# EAGLE design single_ad8232_d1 (EAGLE 9.6.1)
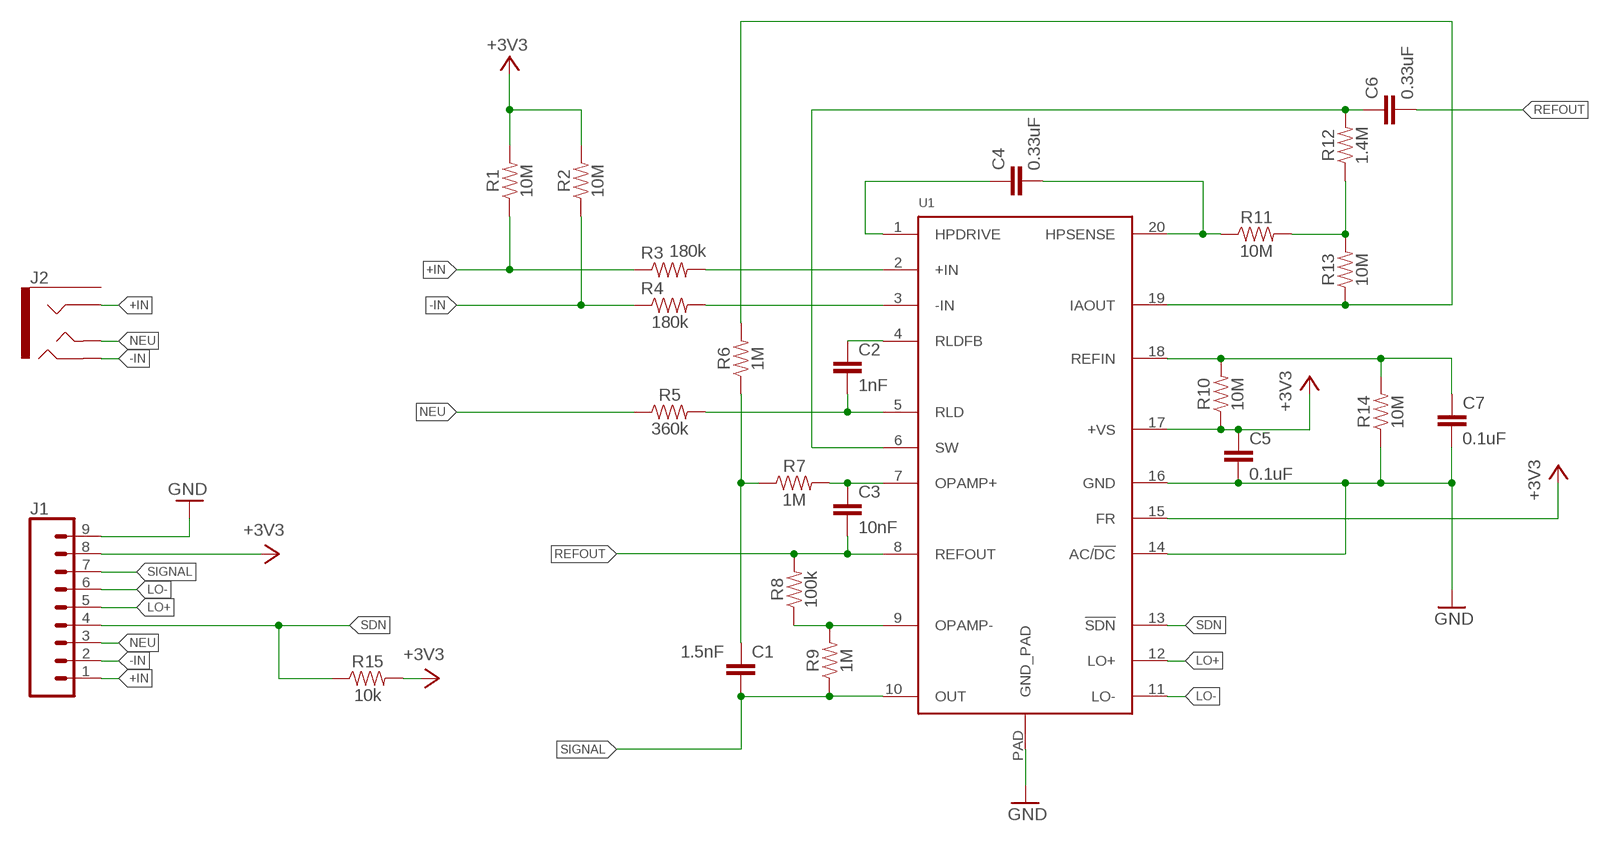
[diagram p0: schematic, sheet 1]

## Parts
C1  1.5nF  CAP0603-CAP  [0603-CAP]
C2  1nF  CAP0603-CAP  [0603-CAP]
C3  10nF  CAP0603-CAP  [0603-CAP]
C4  0.33uF  CAP0805  [0805]
C5  0.1uF  CAP0603-CAP  [0603-CAP]
C6  0.33uF  CAP0805  [0805]
C7  0.1uF  CAP0603-CAP  [0603-CAP]
J1  CONN_09  [1X09]
J2  AUDIO_JACK_TRRSSMD_RA  [AUDIO_JACK_3.5MM_TRRS_SMD_RA]
R1  10M  RESISTOR0603  [0603]
R2  10M  RESISTOR0603  [0603]
R3  180k  RESISTOR0603  [0603]
R4  180k  RESISTOR0603  [0603]
R5  360k  RESISTOR0603  [0603]
R6  1M  RESISTOR0603  [0603]
R7  1M  RESISTOR0603  [0603]
R8  100k  RESISTOR0603  [0603]
R9  1M  RESISTOR0603  [0603]
R10  10M  RESISTOR0603  [0603]
R11  10M  RESISTOR0603  [0603]
R12  1.4M  RESISTOR0603  [0603]
R13  10M  RESISTOR0603  [0603]
R14  10M  RESISTOR0603  [0603]
R15  10k  10KOHM-0603-1/10W-1%  [0603]
U1  AD8232ACPZ-R7  AD8232  [LFCSP_20]

## Nets
+3V3: C5.1 J1.8 R1.2 R2.2 R10.1 R15.2 U1.15(FR) U1.17(+VS)
+IN: J1.1 J2.RING1 R1.1 R3.1
-IN: J1.2 J2.RING2 R2.1 R4.1
GND: C5.2 C7.2 J1.9 R14.1 U1.14(AC/!DC) U1.16(GND) U1.PAD(GND_PAD)
LO+: J1.5 U1.12(LO+)
LO-: J1.6 U1.11(LO-)
N$1: R8.1 R9.2 U1.9(OPAMP-)
N$3: R3.2 U1.2(+IN)
N$4: R4.2 U1.3(-IN)
N$6: C1.1 R6.1 R7.1
N$7: C3.1 R7.2 U1.7(OPAMP+)
N$8: C2.1 U1.4(RLDFB)
N$9: C2.2 R5.2 U1.5(RLD)
N$10: R6.2 R13.1 U1.19(IAOUT)
N$11: C6.1 R12.2 U1.6(SW)
N$12: C7.1 R10.2 R14.2 U1.18(REFIN)
N$13: R11.2 R12.1 R13.2
N$14: C4.2 R11.1 U1.20(HPSENSE)
N$15: C4.1 U1.1(HPDRIVE)
NEU: J1.3 J2.TIP R5.1
REFOUT: C3.2 C6.2 R8.2 U1.8(REFOUT)
SDN: J1.4 R15.1 U1.13(!SDN)
SIGNAL: C1.2 J1.7 R9.1 U1.10(OUT)
Unconnected: J2.EARTH

## Library data of the parts
C1-C7 = SparkFun-Passives:CAP: Capacitor Standard 0603 ceramic capacitor, and 0.1" leaded capacitor.
J1 = SparkFun-Connectors:CONN_09: Multi connection point. Often used as Generic Header-pin footprint for 0.1 inch spaced/style header connections On any of the 0.1 inch spaced packages, you can populate with these: Break Away Headers - Straight <https://www.sparkfun.com/products/116> (PRT-00116) Break Away Male Headers - Right Angle <https://www.sparkfun.com/products/553> (PRT-00553) Female Headers <https://www.sparkfun.com/products/115> (PRT-00115) Break Away Headers - Machine Pin <https://www.sparkfun.com/products/117> (PRT-00117) Break Away Female Headers - Swiss Machine Pin <https://www.sparkfun.com/products/743> (PRT-00743) For SCREWTERMINALS and SPRING TERMINALS visit here: Screw Terimnals on SparkFun.com <https://www.sparkfun.com/search/results?term=Screw+Terminals> (5mm/3.5mm/2.54mm spacing) This device is also useful as a general connection point to wire up your design to another part of your project. Our various solder wires solder well into these plated through hole pads. Hook-Up Wire - Assortment (Stranded, 22 AWG) <https://www.sparkfun.com/products/11375> (PRT-11375) Hook-Up Wire - Assortment (Solid Core, 22 AWG) <https://www.sparkfun.com/products/11367> (PRT-11367) View the entire wire category on our website here <https://www.sparkfun.com/categories/141> Special notes: Molex polarized connector foot print use with SKU : PRT-08231 with associated crimp pins and housings. 1MM SMD Version SKU: PRT-10208 NOTES ON THE VARIANTS LOCK and LOCK_LONGPADS... This footprint was designed to help hold the alignment of a through-hole component (i.e. 6-pin header) while soldering it into place. You may notice that each hole has been shifted either up or down by 0.005 of an inch from it's more standard position (which is a perfectly straight line). This slight alteration caused the pins (the squares in the middle) to touch the edges of the holes. Because they are alternating, it causes a "brace" to hold the component in place. 0.005 has proven to be the perfect amount of "off-center" position when using our standard breakaway headers. Although looks a little odd when you look at the bare footprint, once you have a header in there, the alteration is very hard to notice. Also,if you push a header all the way into place, it is covered up entirely on the bottom side.
J2 = SparkFun-Connectors:AUDIO_JACK_TRRS: Audio Jack - 3.5mm TRRS (SMD) This is a 3.5mm TRRS SMD audio jack. TRRS connectors are the audio-style connectors that you see on some phones, MP3 players and development boards. TRRS stands for “tip, ring, ring, sleeve,” which reflects that this has three conductors and a ground. SparkFun Products: Audio Jack <https://www.sparkfun.com/products/12639> mbed Starter Kit <https://www.sparkfun.com/products/12968> SparkFun TRRS 3.5mm Jack Breakout <https://www.sparkfun.com/products/11570>; PROD_ID: CONN-10676; SF_ID: PRT-12639
R1-R14 = SparkFun-Resistors:RESISTOR: Generic Resistor Package
R15 = SparkFun-Resistors:10KOHM: 10kΩ resistor A resistor is a passive two-terminal electrical component that implements electrical resistance as a circuit element. Resistors act to reduce current flow, and, at the same time, act to lower voltage levels within circuits. - Wikipedia; PROD_ID: RES-00824
U1 = SparkFun-Sensors:AD8232: AD8232 Single Lead Heart Rate Monitor IC Datasheet <https://cdn.sparkfun.com/datasheets/Sensors/Biometric/AD8232.pdf> SparkFun Products SparkFun Single Lead Heart Rate Monitor - AD8232 <https://www.sparkfun.com/products/12650> (SEN-12650); PROD_ID: IC-11886

## Board
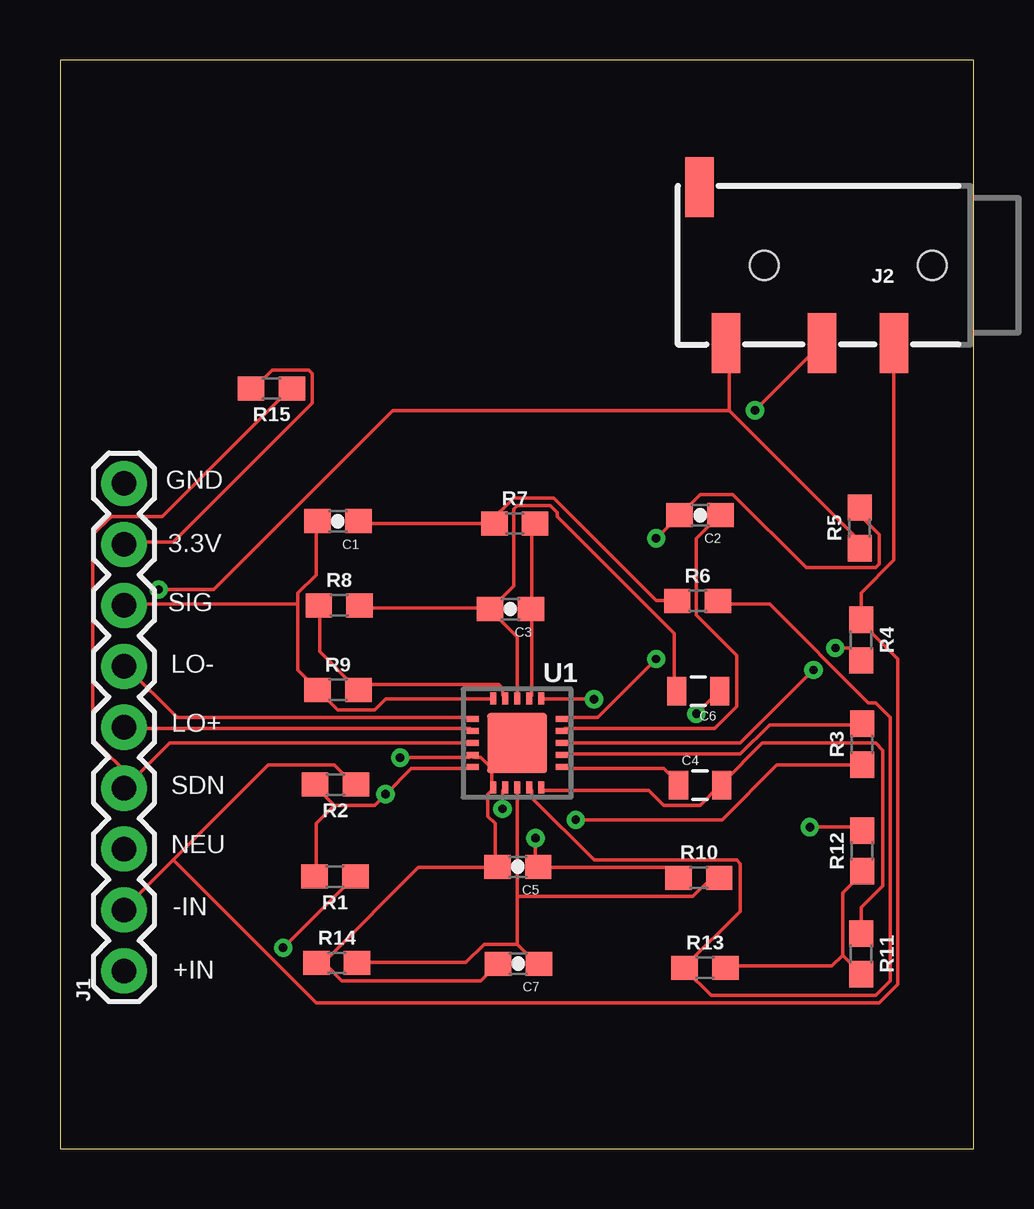
[diagram p1: board, top side]
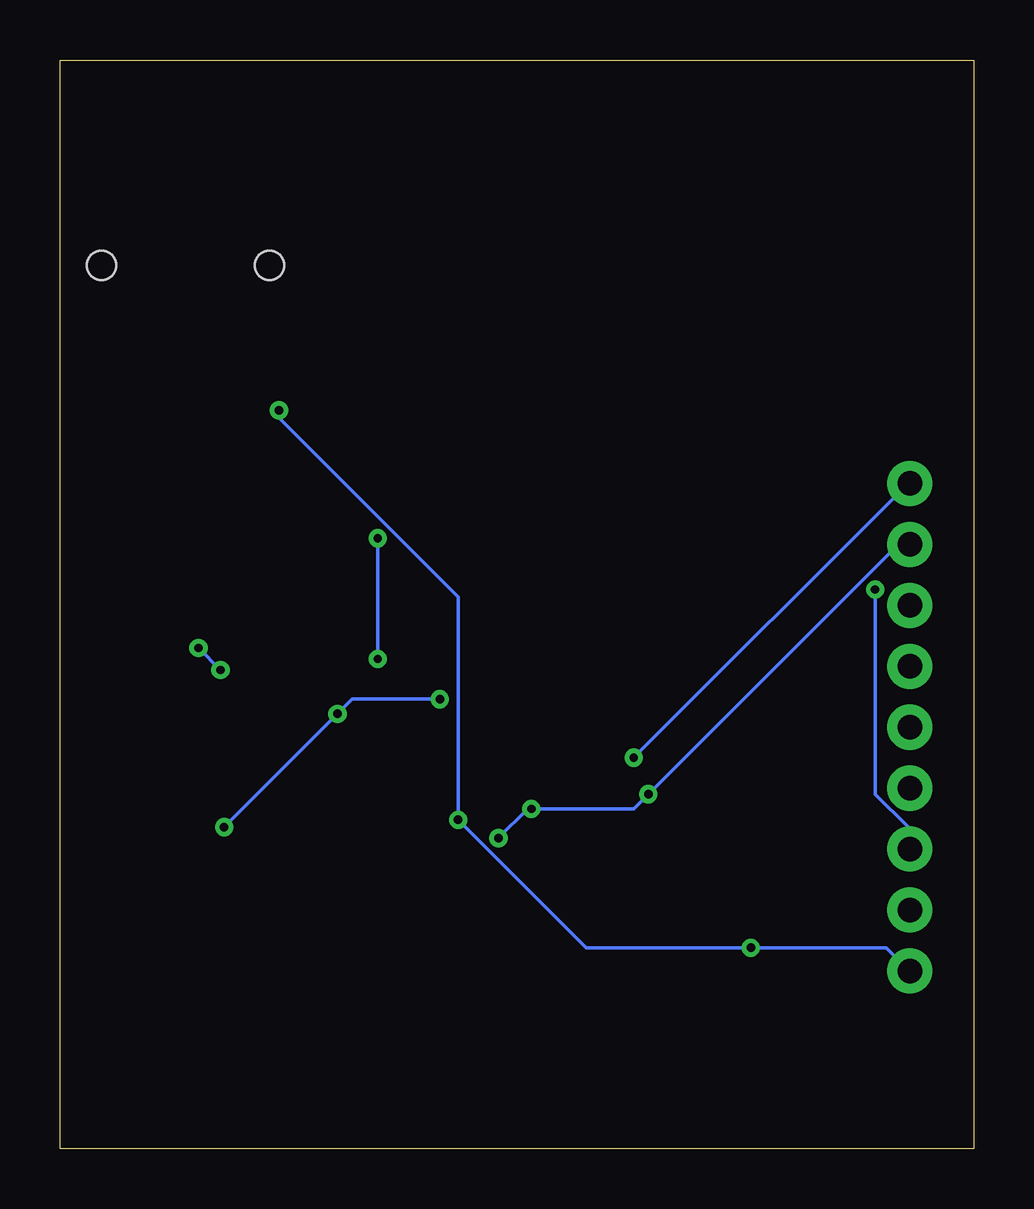
[diagram p2: board, bottom side, seen from below]

Size 38.08 x 45.39 mm. Coordinates in mm from the lower left corner, seen from the top.
Outline: 0,0 38.08,0 38.08,45.39 0,45.39 0,0
Copper layers (1*16): Top 0.035mm / dielectric 1.5mm / Bottom 0.035mm
Design rules "default": minimum track width 6mil, minimum drill 0.35mm, track to track 6mil, track to pad 6mil, pad to pad 6mil, via to via 6mil, smd to smd 6mil, copper to edge 40mil, drill to drill 6mil, minimum pad ring 10mil, minimum via ring 8mil, stop-mask expansion 4mil, vias tented up to drill 0mil, thermal gap 10mil

### Footprints (pad centres in the part's own frame; a part is rotated, then mirrored left to right if it is on the bottom)
0603-CAP = smd 1.1 x 1: 1 -0.85,0; 2 0.85,0
0805 = smd 0.8 x 1.2: 1 -0.9,0; 2 0.9,0
1X09 = drill 1.016 pad 1.88: 1 0,0; 2 2.54,0; 3 5.08,0; 4 7.62,0; 5 10.16,0; 6 12.7,0; 7 15.24,0; 8 17.78,0; 9 20.32,0
AUDIO_JACK_3.5MM_TRRS_SMD_RA = smd 1.2 x 2.5: EARTH 11.3,-3.25; RING1 6.2,3.25; RING2 3.2,3.25; TIP 10.2,3.25 | hole 1.2: 1.6,0; 8.6,0
0603 = smd 1.1 x 1: 1 -0.85,0; 2 0.85,0
LFCSP_20 = smd 0.5 x 0.25: 1 -1.85,1; 2 -1.85,0.5; 3 -1.85,0; 4 -1.85,-0.5; 5 -1.85,-1; 11 1.85,-1; 12 1.85,-0.5; 13 1.85,0; 14 1.85,0.5; 15 1.85,1 | smd 0.25 x 0.5: 6 -1,-1.85; 7 -0.5,-1.85; 8 0,-1.85; 9 0.5,-1.85; 10 1,-1.85; 16 1,1.85; 17 0.5,1.85; 18 0,1.85; 19 -0.5,1.85; 20 -1,1.85 | smd 2.5 x 2.5: PAD 0,0

### Placement (x,y rotation side)
C1  11.58,26.16 180 top
C2  26.67,26.42 180 top
C3  18.77,22.5 180 top
C4  26.67,15.16 0 top
C5  19.08,11.76 180 top
C6  26.59,19.08 180 top
C7  19.1,7.72 180 top
J1  2.67,7.42 90 top
J2  37.95,36.83 180 top
R1  11.46,11.35 180 top
R2  11.48,15.19 180 top
R3  33.43,16.87 90 top
R4  33.38,21.21 270 top
R5  33.32,25.88 90 top
R6  26.57,22.83 0 top
R7  18.95,26.06 0 top
R8  11.63,22.66 0 top
R9  11.58,19.13 0 top
R10  26.62,11.3 0 top
R11  33.38,8.13 270 top
R12  33.43,12.42 90 top
R13  26.87,7.54 0 top
R14  11.53,7.75 0 top
R15  8.81,31.7 180 top
U1  19.05,16.92 180 top

### Tracks (layer width: path | path; a pad name or v marks a point on that pad's centre or on a via)
+3V3  (via drill 0.35)
  Top 0.152: 11.43,14.33 13.11,14.33 v13.56,14.78 14.63,15.85 17.07,15.85 U1.15 | 11.43,14.33 10.67,15.09 R2.2 | 11.43,14.33 10.67,13.56 10.67,11.43 R1.2 | R10.1 25.76,11.43 25.45,11.73 19.96,11.73 C5.1 19.81,11.89 v19.81,12.95 | v18.44,14.17 18.44,14.94 U1.17 | R15.2 8.08,31.7 8.84,32.46 10.36,32.46 10.52,32.31 10.52,31.09 4.72,25.3 2.74,25.3 J1.8
  Bottom 0.152: J1.8 2.74,25.15 3.2,25.15 v13.56,14.78 14.17,14.17 v18.44,14.17 18.59,14.17 v19.81,12.95
+IN  (via drill 0.35)
  Top 0.152: v9.3,8.38 12.19,11.28 R1.1 | v21.49,13.72 27.58,13.72 29.87,16 33.38,16 R3.1 | v28.96,30.79 31.7,33.53 J2.RING1
  Bottom 0.152: J1.1 2.74,7.47 3.66,8.38 v9.3,8.38 16.15,8.38 v21.49,13.72 21.49,23.01 28.96,30.48 v28.96,30.79
-IN
  Top 0.152: J2.RING2 34.75,33.53 34.75,24.54 33.38,23.16 R4.1 33.38,21.95 34.9,20.42 34.9,6.86 34.14,6.1 10.67,6.1 4.72,12.04 | 4.72,12.04 2.74,10.06 J1.2 | 4.72,12.04 8.69,16 11.43,16 12.19,15.24 R2.1
GND  (via drill 0.35)
  Top 0.152: 11.12,7.62 10.82,7.62 R14.1 11.12,7.62 | 11.12,7.62 11.73,7.01 17.53,7.01 18.14,7.62 C7.2 | 17.98,15.85 17.98,15.09 U1.16 17.98,14.94 17.83,14.78 17.83,13.87 18.14,13.56 18.14,11.89 C5.2 18.14,11.73 14.94,11.73 11.12,7.92 11.12,7.62 | 17.98,15.85 17.53,16.31 17.22,16.31 U1.14 17.07,16.31 v14.17,16.31 | 17.98,15.85 U1.PAD
  Bottom 0.152: v14.17,16.31 2.74,27.74 J1.9
LO+
  Top 0.152: U1.12 17.07,17.53 2.74,17.53 J1.5
LO-
  Top 0.152: U1.11 17.07,17.98 4.88,17.98 2.74,20.12 J1.6
N$1
  Top 0.152: U1.9 18.44,18.9 18.44,19.2 18.29,19.36 12.65,19.36 12.5,19.2 R9.2 12.34,19.2 10.82,20.73 10.82,22.55 R8.1
N$3
  Top 0.152: U1.2 21.03,16.46 28.35,16.46 29.57,17.68 33.38,17.68 R3.2
N$4  (via drill 0.35)
  Top 0.152: U1.3 28.35,16.92 v31.39,19.96 | v32.31,20.88 32.92,20.88 33.38,20.42 R4.2
  Bottom 0.152: v32.31,20.88 v31.39,19.96
N$6
  Top 0.152: 17.83,26.06 12.5,26.06 C1.1 | 17.83,26.06 R7.1 | 17.83,26.06 18.9,27.13 20.57,27.13 24.84,22.86 25.6,22.86 R6.1
N$7
  Top 0.152: U1.7 19.66,18.9 19.66,22.4 C3.1 19.66,22.55 19.66,26.06 R7.2
N$8
  Top 0.152: U1.4 21.03,17.53 27.28,17.53 28.19,18.44 28.19,20.57 26.52,22.25 26.52,25.45 27.43,26.36 C2.1
N$9  (via drill 0.35)
  Top 0.152: v24.84,20.42 22.4,17.98 21.03,17.98 U1.5 | v24.84,25.45 25.76,26.36 C2.2 25.91,26.52 26.67,27.28 28.04,27.28 31.09,24.23 33.98,24.23 34.14,24.38 34.14,25.6 33.38,26.36 33.38,26.67 R5.2
  Bottom 0.152: v24.84,25.45 v24.84,20.42
N$10
  Top 0.152: U1.19 19.66,14.94 19.66,14.63 22.25,12.04 28.19,12.04 28.35,11.89 28.35,9.91 26.06,7.62 R13.1 26.06,7.47 27.13,6.4 33.98,6.4 34.59,7.01 34.59,17.98 33.98,18.59 33.68,18.59 29.57,22.71 27.43,22.71 R6.2
N$11  (via drill 0.35)
  Top 0.152: v22.25,18.75 20.12,18.75 U1.6 | v26.52,18.14 27.43,19.05 C6.1 | v31.24,13.41 33.38,13.41 R12.2
  Bottom 0.152: v22.25,18.75 25.91,18.75 v26.52,18.14 v31.24,13.41
N$12
  Top 0.152: 19.05,8.53 19.05,10.52 | 19.05,10.52 U1.18 | 19.05,8.53 19.81,7.77 C7.1 | 19.05,8.53 17.68,8.53 16.92,7.77 12.5,7.77 R14.2 | 19.05,10.52 26.36,10.52 27.13,11.28 27.43,11.28 R10.2
N$13
  Top 0.152: 32.61,8.08 33.38,7.32 R11.2 | 32.61,8.08 32.61,10.67 33.38,11.43 R12.1 | 32.61,8.08 32.16,7.62 27.74,7.62 R13.2
N$14
  Top 0.152: U1.20 20.12,14.94 24.54,14.94 25.15,14.33 26.67,14.33 27.43,15.09 C4.2 27.58,15.24 29.26,16.92 33.98,16.92 34.29,16.61 34.29,10.97 33.38,10.06 R11.1
N$15
  Top 0.152: U1.1 21.03,15.85 25.15,15.85 25.76,15.24 C4.1
NEU  (via drill 0.35)
  Top 0.152: 27.89,30.79 33.22,25.45 33.22,25.15 R5.1 | 27.89,30.79 27.89,33.53 J2.TIP | v4.12,23.32 6.4,23.32 13.87,30.79 27.89,30.79
  Bottom 0.152: v4.12,23.32 4.12,14.78 2.74,13.41 2.74,12.5 J1.3
REFOUT
  Top 0.152: U1.8 19.05,21.34 17.98,22.4 C3.2 | R8.2 12.5,22.55 17.83,22.55 C3.2 | C6.2 25.6,19.2 25.6,21.49 20.73,26.36 20.73,26.52 20.42,26.82 19.05,26.82 18.9,26.67 18.9,23.47 17.98,22.55 C3.2
SDN
  Top 0.152: U1.13 4.57,16.92 3.05,15.39 | 3.05,15.39 2.74,15.09 J1.4 3.05,15.39 | 3.05,15.39 1.37,17.07 1.37,25.6 2.13,26.36 4.27,26.36 9.6,31.7 R15.1
SIGNAL
  Top 0.152: U1.10 17.98,18.75 13.56,18.75 13.11,18.29 11.58,18.29 10.82,19.05 R9.1 10.67,19.2 9.91,19.96 9.91,22.71 | 9.91,22.71 9.91,23.16 10.67,23.93 10.67,26.06 C1.2 | 9.91,22.71 2.74,22.71 J1.7

### Text on the board
tNames: GND | 3.3V | SIG | LO- | LO+ | SDN | NEU | -IN | +IN